# Altium schematic sheet ANALOG_IOUTPUT.SchDoc
size A4; SheetNumber: 8; SheetTotal: 17
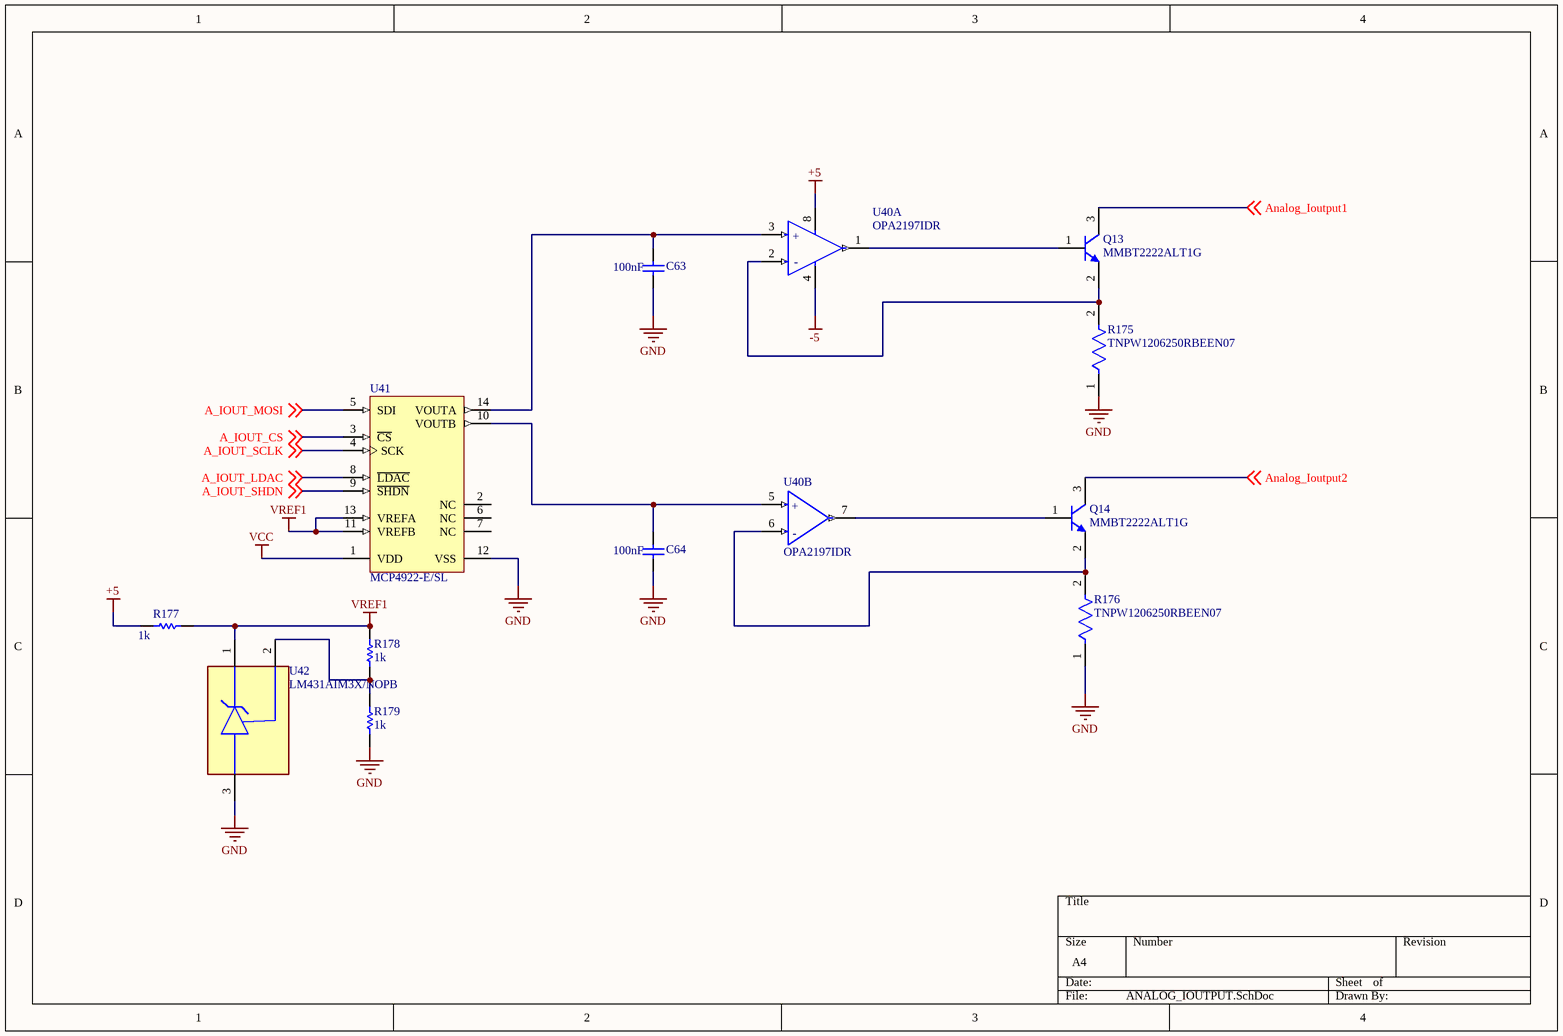
[diagram p0: ANALOG_IOUTPUT.SchDoc]

## Parts
C63  Capacitance: 100nF  [CAPC2013X135X45ML10T25]  (hidden comment: GRM21BR71H104KA01L)
C64  Capacitance: 100nF  [CAPC2013X135X45ML10T25]  (hidden comment: GRM21BR71H104KA01L)
Q13  MMBT2222ALT1G  [ONSC-SOT-23-3-318-08_V]
Q14  MMBT2222ALT1G  [ONSC-SOT-23-3-318-08_V]
R175  TNPW1206250RBEEN07  [FP-TNPW1206-e3-MFG]
R176  TNPW1206250RBEEN07  [FP-TNPW1206-e3-MFG]
R177  value 1k  [RESC2013X50X30NL20T20]  (hidden comment: CRCW08051K00FKTC)
R178  value 1k  [RESC2013X50X30NL20T20]  (hidden comment: CRCW08051K00FKTC)
R179  value 1k  [RESC2013X50X30NL20T20]  (hidden comment: CRCW08051K00FKTC)
U40  OPA2197IDR  [FP-D0008A-MFG]  (parts A,B of 2)
U41  MCP4922-E/SL  [SOIC-SL14_M]
U42  LM431AIM3X/NOPB  [FP-DBZ0003A-IPC_B]

## Nets
+5: R177.1 U40.8(V+)
-5: U40.4(V-)
GND: C63.1 C64.1 R175.1 R176.1 R179.1 U41.12(VSS) U42.3(A)
VCC: U41.1(VDD)
VREF1: R177.2 R178.2 U41.11(VREFB) U41.13(VREFA) U42.1(C)
A_IOUT_CS: U41.3(~{CS}) ; off-sheet A_IOUT_CS
A_IOUT_LDAC: U41.8(~{LDAC}) ; off-sheet A_IOUT_LDAC
A_IOUT_MOSI: U41.5(SDI) ; off-sheet A_IOUT_MOSI
A_IOUT_SCLK: U41.4(SCK) ; off-sheet A_IOUT_SCLK
A_IOUT_SHDN: U41.9(~{SHDN}) ; off-sheet A_IOUT_SHDN
Analog_Ioutput1: Q13.3(C) ; off-sheet Analog_Ioutput1
Analog_Ioutput2: Q14.3(C) ; off-sheet Analog_Ioutput2
NetC63_2: C63.2 U40.3(+IN_A) U41.14(VOUTA)
NetC64_2: C64.2 U40.5(+IN_B) U41.10(VOUTB)
NetQ13_1: Q13.1(B) U40.1(OUT_A)
NetQ13_2: Q13.2(E) R175.2 U40.2(-IN_A)
NetQ14_1: Q14.1(B) U40.7(OUT_B)
NetQ14_2: Q14.2(E) R176.2 U40.6(-IN_B)
NetR178_1: R178.1 R179.2 U42.2(REF)

Not connected (* = marked no-connect by the designer): U41 2(NC) 6(NC) 7(NC)

## Notes on the sheet
- (in symbol CMP-04895-000044-1, part A) +; -
- (in symbol CMP-04895-000044-1, part B) +; -

## Library data of the parts
C63 C64 = CMP-2100-03644-1: Chip Capacitor, 0.1 uF, +/- 10%, 50 V, -55 to 125 degC, 0805 (2012 Metric), RoHS, Tape and Reel; Manufacturer: Murata; Voltage: 50V; Insulation Resistance: 10GR; Dielectric Material: Ceramic; Dielectric: X7R; Package Description: 2-Pin Surface Mount Device, Body 2 x 1.25 mm; Manufacturer URL: http://www.murata.com/; Case Code (Imperial): 0805; Datasheet URL: http://psearch.en.murata.com/capacitor/product/GRM21BR71H104KA01%23.pdf; Termination: SMD/SMT; Lead Free: LeadFree; Package Quantity: 1; Mount: SurfaceMount; REACH SVHC: Unknown; Thickness: 0.053inch; Height: 1.25mm; Case/Package: 0805; Voltage Rating: 50V; Width: 0.049inch; Case Code (Metric): 2012; Material: Ceramic; Min Operating Temperature: -55degC; RoHSCompliant: true; Datasheet Version: 42675.0; Voltage Rating (DC): 50V; Tolerance: 10%; Package Reference: 0805; Depth: 1.25mm; Length: 2mm; Max Operating Temperature: 125degC; Packaging: TapeandReel; Number of Pins: 2; Radiation Hardening: No
Q13 Q14 = CMP-1048-00538-1: General Purpose Transistor, NPN Silicon, 3-Pin SOT-23, Pb-Free, Tape and Reel; Manufacturer: On Semiconductor; fT Min (MHz): 300; IC Continuous (A): 0.6; ComponentLink3URL: http://www.onsemi.cn/pub_link/Collateral/318-08.PDF; PartNumber: MMBT2222ALT1G; RoHS: TRUE; ComponentLink1URL: http://www.onsemi.com/; ComponentLink3Description: Package Specification; ComponentLink2Description: Datasheet; Mounting Technology: Surface Mount; Packing: Tape and Reel; PackageDescription: 3-Pin Small Outline Transistor, Body 2.92 x 1.3 mm, Pitch 0.95 mm; DatasheetVersion: Rev. 10; PackageReference: SOT-23-3-318-08; ComponentLink2URL: http://www.onsemi.cn/pub_link/Collateral/MMBT2222LT1-D.PDF; Polarity: NPN; PackageVersion: Rev. AP, 11/2009; ComponentLink1Description: Manufacturer URL
R175 R176 = CMP-02407-012799-1: Res Thnflm 1206 250R Ohm 0.1% 1/4W 25PPM/C SMD; Power Rating: 250mW; Temperature Coefficient: 25ppm/°C; Voltage Rating: 200V; Resistance: 250R; Length: 3.2mm; Package Quantity: 5000; Height: 0.55mm; Weight: 0.000571oz; Resistor Type: Thin Film; Tolerance: 0.1%; Packaging: Tape and Reel; Case/Package: 1206; Contact Plating: Tin; Min Operating Temperature: -55°C; Case Code (Imperial): 1206; Case Code (Metric): 3216; Width: 1.6mm; Termination: SMD/SMT; Series: TNPW e3; Max Operating Temperature: 125°C
R177-R179 = CMP-2001-04268-1: Manufacturer: Vishay Dale; Part Number: CRCW08051K00FKTC
U40 = CMP-04895-000044-1: IC OP AMP GP RR 10MHZ 8-SOIC; Manufacturer: Texas Instruments; Output Current Per Channel: 65mA; Min Supply Voltage: 4.5V; Input Offset Voltage: 0.025mV; Number Of Channels: 2; Voltage Gain: 134-143dB; Max Dual Supply Voltage: 18V; Min Dual Supply Voltage: 2.25V; Standoff Height: 0.11mm; Max Supply Voltage: 36V; Input Bias Current: 0.000005uA; Nominal Supply Current: 1mA; Max Junction Temp: +150°C; Temperature Range Low: -40°C; Package: D0008A; Temperature: -40°C to +125°C; Gain Bandwidth: 10MHz; Category: IC; Digikey Description: IC OP AMP GP RR 10MHZ 8-SOIC; Automotive: No; Height: 1.75mm; Ambient Temperature Range Low: -40°C; Device Class L3: Amplifiers - Op Amps; ComponentLink2URL: http://www.ti.com/lit/ds/symlink/opa2197.pdf; Lead Free: Yes; RoHS: TRUE; Manufacturer Part Number: OPA2197IDR; Device Class L1: Integrated Circuits (ICs); ComponentLink2Description: Datasheet; Ipc Land Pattern Name: SOIC127P600X175-8; Device Class L2: Linear ICs; Temperature Range High: +125°C; Octopart: https://octopart.com/opa2197idr-texas+instruments-75179702; Ambient Temperature Range High: +125°C
U41 = CMP-0188-00496-2: 12-Bit DAC with SPI Interface, 14-Pin SOIC 150mil, Extended Temperature; ComponentLink2Description: Datasheet; DatasheetVersion: revA, Apr-2010; RevisionNote: URLs added. DatasheetVersion updated. Sch updated.; Code_IPC: SOIC127P600-14; PackageVersion: revBB, Aug-2009; PackageReference: SOIC-SL14; ComponentLink3URL: http://www.microchip.com/stellent/groups/techpub_sg/documents/packagingspec/en012702.pdf; ComponentLink3Description: Package Specification; ComponentLink2URL: http://ww1.microchip.com/downloads/en/DeviceDoc/22250A.pdf; ComponentLink1URL: http://www.microchip.com/; Code_JEDEC: MS-012-AB; PackageDescription: 14-Lead Plastic Small Outline (SL) - Narrow, 3.90mm Body [SOIC]; ComponentLink1Description: Manufacturer URL
U42 = CMP-04916-000022-1: IC VREF SHUNT 37V 2.2% SOT23-3; Temperature Coefficient: 50ppm/°C; Tolerance: 2%; Max Output Current: 100mA; Cathode Current: 1mA; Number of Channels: 1; Radiation Hardening: No; Packaging: Tape and Reel; Package Quantity: 3000; Max Output Voltage: 37V; Max Input Voltage: 37V; Min Operating Temperature: -40°C; Case/Package: SOT-23; Lead Free: Lead Free; Number of Pins: 3; Output Current: 100mA; RoHS Compliant: Yes; Max Operating Temperature: 85°C; Reference Type: Shunt; Output Voltage: 37V; Mount: Surface Mount